# EAGLE design mosfetSwitch (EAGLE 9.2.2)
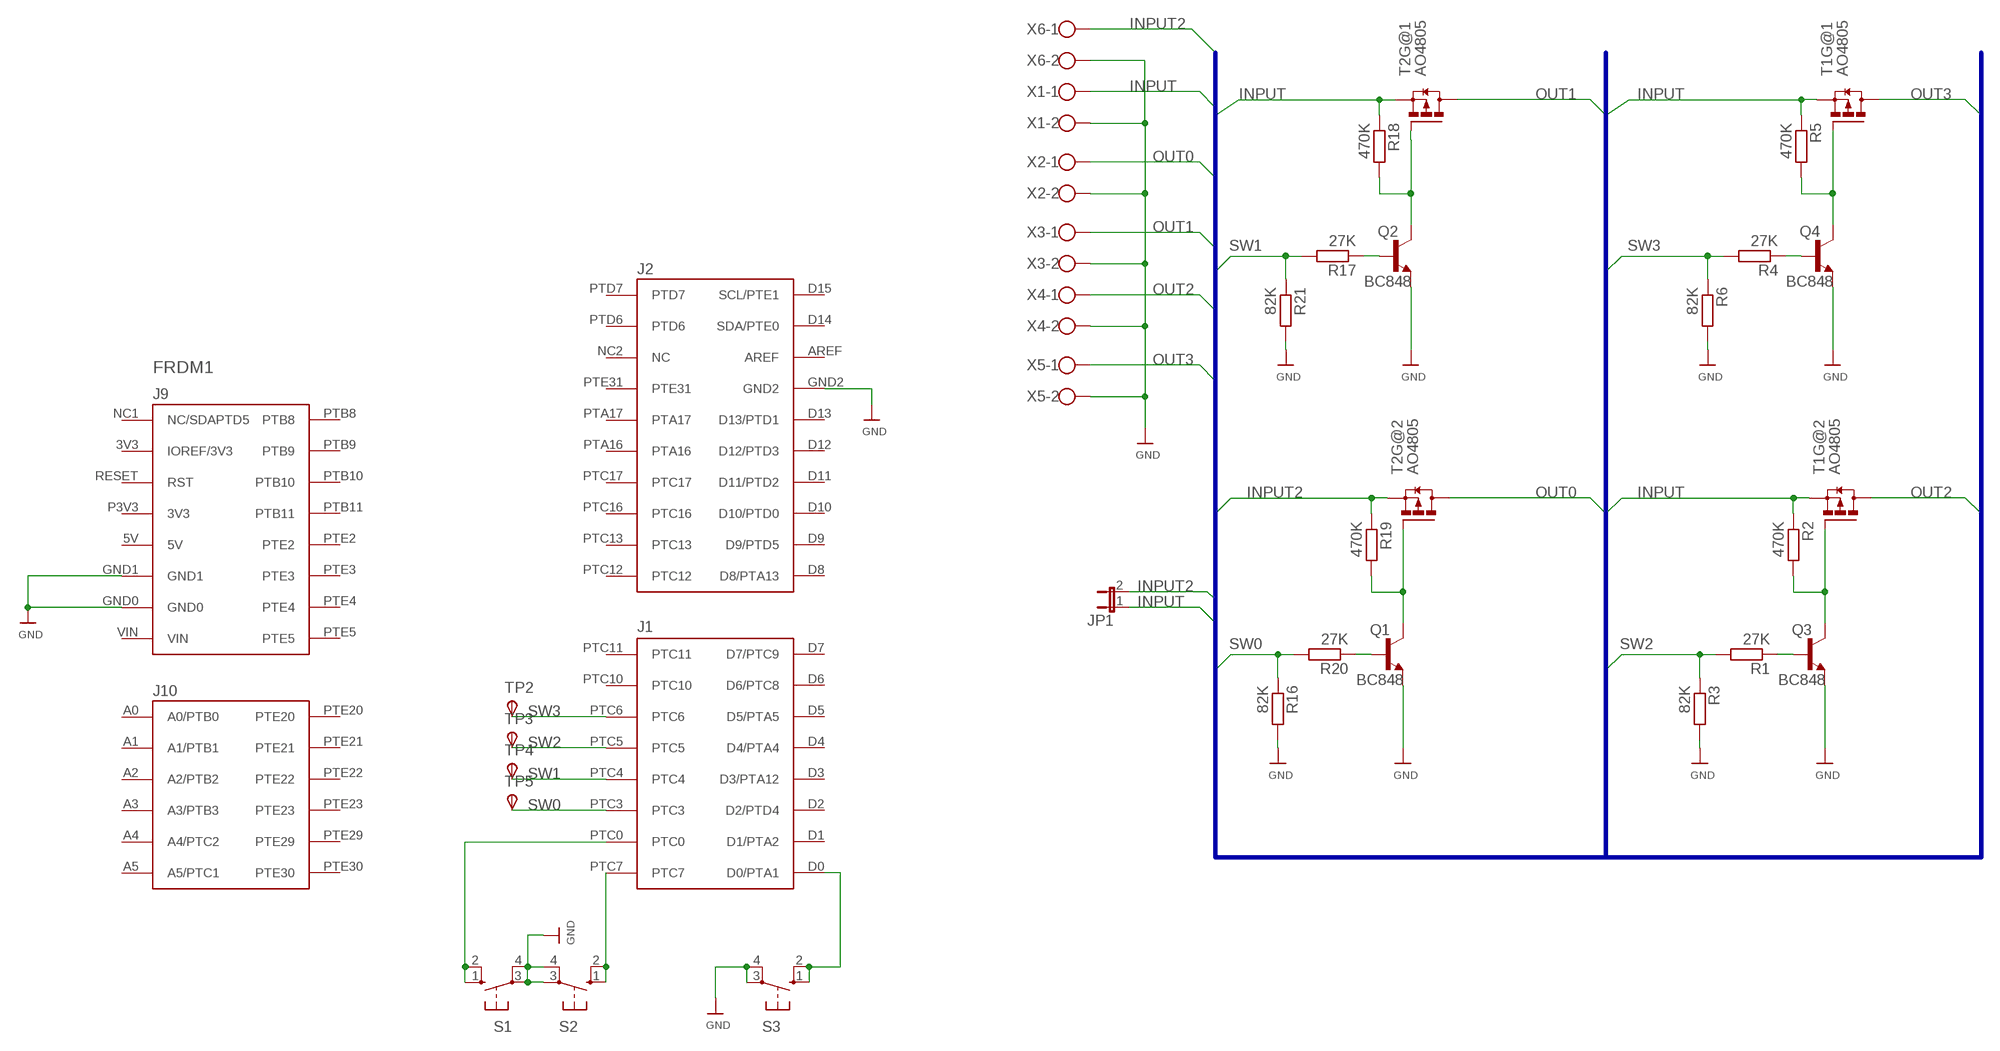
[diagram p0: schematic, sheet 1]

## Parts
FRDM1  FRDM-KL25ZNORMAL  [FRDM_KL25Z_NORMAL]
JP1  JP1E  [JP1]
Q1  BC848  [SOT23]
Q2  BC848  [SOT23]
Q3  BC848  [SOT23]
Q4  BC848  [SOT23]
R1  27K  R-EU_R0805  [R0805]
R2  470K  R-EU_R0805  [R0805]
R3  82K  R-EU_R0805  [R0805]
R4  27K  R-EU_R0805  [R0805]
R5  470K  R-EU_R0805  [R0805]
R6  82K  R-EU_R0805  [R0805]
R16  82K  R-EU_R0805  [R0805]
R17  27K  R-EU_R0805  [R0805]
R18  470K  R-EU_R0805  [R0805]
R19  470K  R-EU_R0805  [R0805]
R20  27K  R-EU_R0805  [R0805]
R21  82K  R-EU_R0805  [R0805]
S1  10-XX3D  [B3F-10XX_2]
S2  10-XX3D  [B3F-10XX_2]
S3  10-XX3D  [B3F-10XX_2]
T1  AO4805  [SOIC127P600X175-8]
T2  AO4805  [SOIC127P600X175-8]
TP2  TPSB2,54  [B2,54]
TP3  TPSB2,54  [B2,54]
TP4  TPSB2,54  [B2,54]
TP5  TPSB2,54  [B2,54]
X1  W237-102  [W237-102]
X2  W237-102  [W237-102]
X3  W237-102  [W237-102]
X4  W237-102  [W237-102]
X5  W237-102  [W237-102]
X6  W237-102  [W237-102]

## Nets
GND [power]: FRDM1.GND0 FRDM1.GND1 FRDM1.GND2 Q1.2(E) Q2.2(E) Q3.2(E) Q4.2(E) R3.2 R6.2 R16.2 R21.2 S1.3(P) S1.4(P1) S2.3(P) S2.4(P1) S3.3(P) S3.4(P1) X1.2 X2.2 X3.2 X4.2 X5.2 X6.2
INPUT [power]: JP1.1 R2.1 R5.1 R18.1 T1.1(G@2:S) T1.3(G@1:S) T2.3(G@1:S) X1.1
INPUT2 [power]: JP1.2 R19.1 T2.1(G@2:S) X6.1
N$1: Q3.1(B) R1.1
N$2: Q3.3(C) R2.2 T1.2(G@2:G)
N$3: Q2.1(B) R17.1
N$4: Q2.3(C) R18.2 T2.4(G@1:G)
N$5: Q4.1(B) R4.1
N$6: Q4.3(C) R5.2 T1.4(G@1:G)
N$7: FRDM1.PTC0 S1.1(S) S1.2(S1)
N$8: FRDM1.D0(D0/PTA1) S3.1(S) S3.2(S1)
N$9: Q1.1(B) R20.1
N$11: FRDM1.PTC7 S2.1(S) S2.2(S1)
N$21: Q1.3(C) R19.2 T2.2(G@2:G)
OUT0 [power]: T2.7(G@2:D) T2.8(G@2:D) X2.1
OUT1 [power]: T2.5(G@1:D) T2.6(G@1:D) X3.1
OUT2 [power]: T1.7(G@2:D) T1.8(G@2:D) X4.1
OUT3 [power]: T1.5(G@1:D) T1.6(G@1:D) X5.1
SW0: FRDM1.PTC3 R16.1 R20.2 TP5.TP(PP)
SW1: FRDM1.PTC4 R17.2 R21.1 TP4.TP(PP)
SW2: FRDM1.PTC5 R1.2 R3.1 TP3.TP(PP)
SW3: FRDM1.PTC6 R4.2 R6.1 TP2.TP(PP)
Unconnected: FRDM1.3V3(IOREF/3V3) FRDM1.5V FRDM1.A0(A0/PTB0) FRDM1.A1(A1/PTB1) FRDM1.A2(A2/PTB2) FRDM1.A3(A3/PTB3) FRDM1.A4(A4/PTC2) FRDM1.A5(A5/PTC1) FRDM1.AREF FRDM1.D1(D1/PTA2) FRDM1.D2(D2/PTD4) FRDM1.D3(D3/PTA12) FRDM1.D4(D4/PTA4) FRDM1.D5(D5/PTA5) FRDM1.D6(D6/PTC8) FRDM1.D7(D7/PTC9) FRDM1.D8(D8/PTA13) FRDM1.D9(D9/PTD5) FRDM1.D10(D10/PTD0) FRDM1.D11(D11/PTD2) FRDM1.D12(D12/PTD3) FRDM1.D13(D13/PTD1) FRDM1.D14(SDA/PTE0) FRDM1.D15(SCL/PTE1) FRDM1.NC1(NC/SDAPTD5) FRDM1.NC2(NC) FRDM1.P3V3(3V3) FRDM1.PTA16 FRDM1.PTA17 FRDM1.PTB8 FRDM1.PTB9 FRDM1.PTB10 FRDM1.PTB11 FRDM1.PTC10 FRDM1.PTC11 FRDM1.PTC12 FRDM1.PTC13 FRDM1.PTC16 FRDM1.PTC17 FRDM1.PTD6 FRDM1.PTD7 FRDM1.PTE2 FRDM1.PTE3 FRDM1.PTE4 FRDM1.PTE5 FRDM1.PTE20 FRDM1.PTE21 FRDM1.PTE22 FRDM1.PTE23 FRDM1.PTE29 FRDM1.PTE30 FRDM1.PTE31 FRDM1.RESET(RST) FRDM1.VIN

## Buses
INPUT,INPUT2,OUT[0..5],SW[0..5]

## Library data of the parts
FRDM1 = Freedom:FRDM-KL25Z: For creating FRDM-KL25Z shields
JP1 = jumper:JP1E: JUMPER
Q1-Q4 = transistor:BC848: NPN TRANSISTOR
R1-R6 R16-R21 = rcl:R-EU_: RESISTOR, European symbol; SPICEPREFIX: R
S1-S3 = misc:10-XX: OMRON SWITCH
T1 T2 = tranzistor:AO4805: Tranzistor: P-MOSFET x2; unipolárny; -30V; -7A; 1,3W; https://www.tme.eu/sk/details/ao4805/tranzistory-viackanalove/alpha-omega-semiconductor/; TME_SYMBOL: AO4805
TP2-TP5 = testpad:TPS: TEST PIN
X1-X6 = con-wago-500:W237-102: WAGO SCREW CLAMP; MPN: 237-102; OC_FARNELL: unknown; OC_NEWARK: 70K9898

## Net classes
0 default: width 0.406 mm, drill 1.016 mm, clearance 0.305 mm
1 power: width 1.067 mm, drill 0.508 mm, clearance 0.305 mm
2 lowPower: width 0.406 mm, drill 0.305 mm, clearance 0.254 mm

## Board
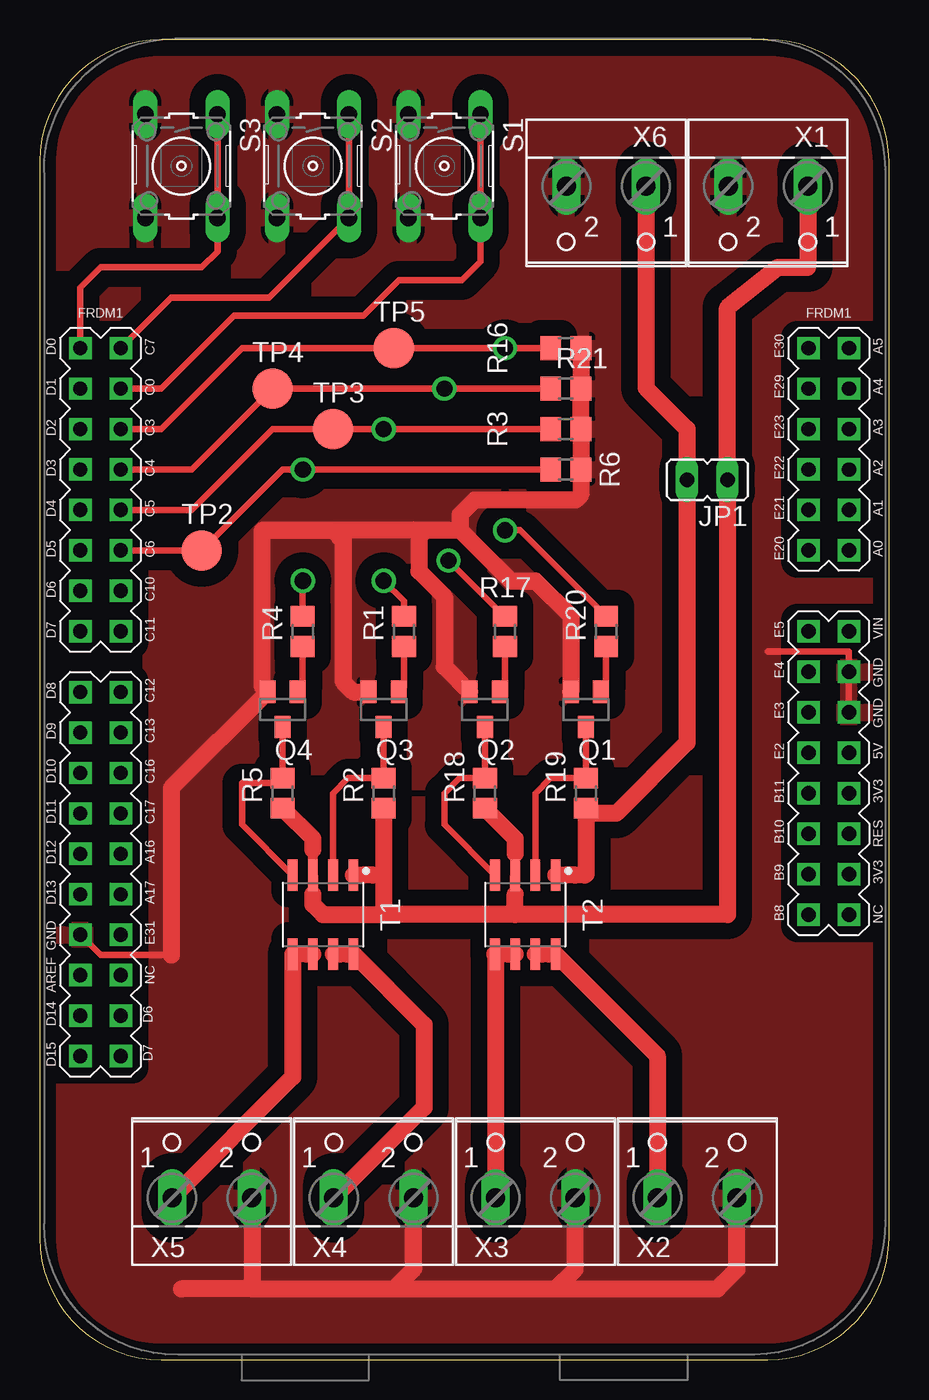
[diagram p1: board, top side]
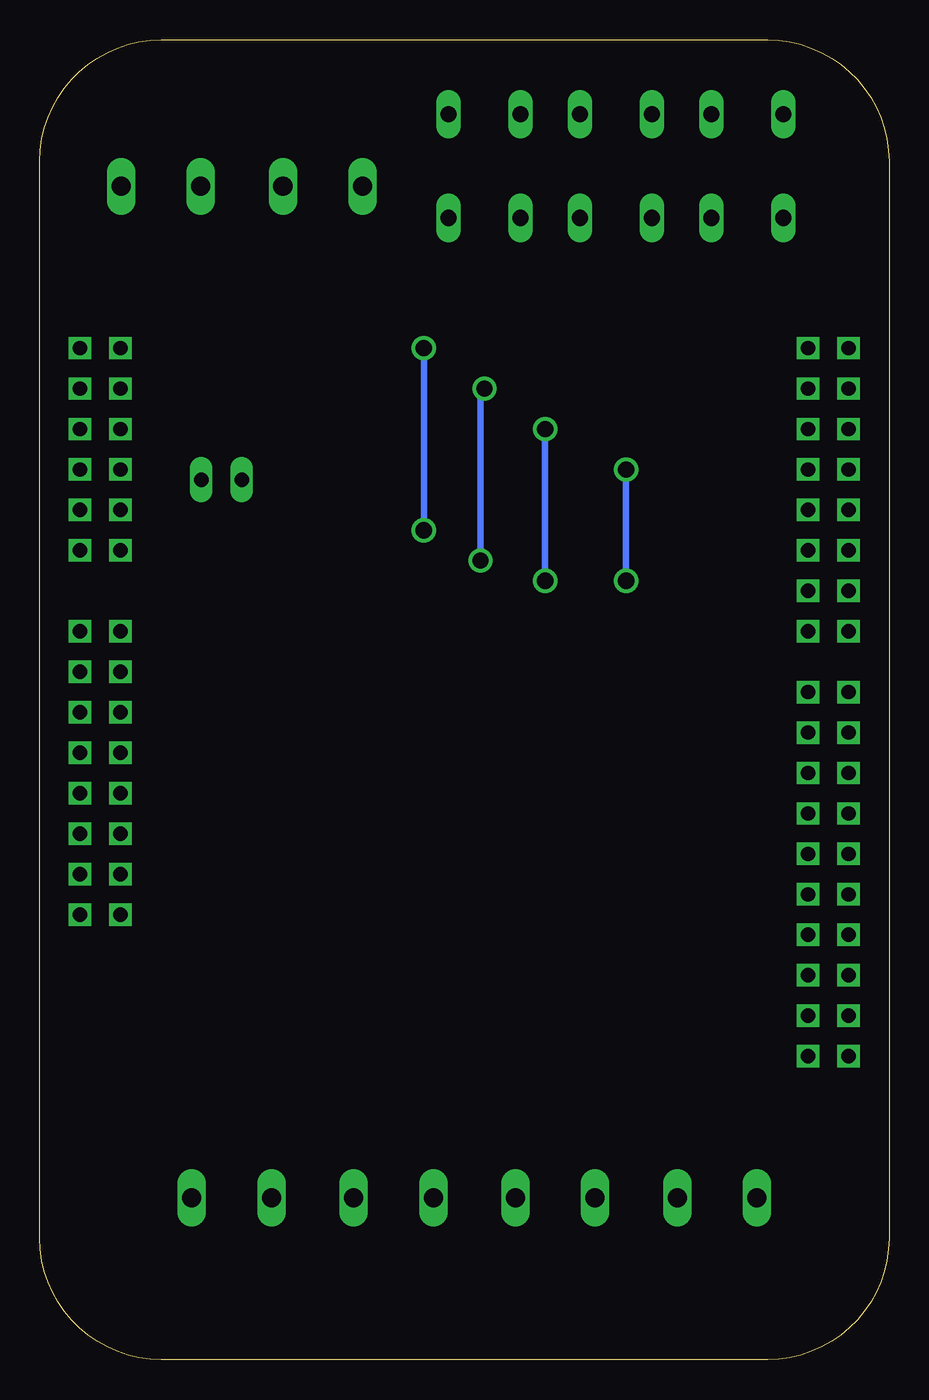
[diagram p2: board, bottom side, seen from below]

Size 53.32 x 82.86 mm. Coordinates in mm from the lower left corner, seen from the top.
Outline: 0,75.23 0,7.62 arc90 7.62,0 45.7,0 arc90 53.32,7.62 53.32,75.23 arc90 45.7,82.86 7.62,82.86 arc90 0,75.23
Copper layers (1*16): Top 0.035mm / dielectric 1.5mm / Bottom 0.035mm
Design rules "default": minimum track width 6mil, minimum drill 0.35mm, track to track 6mil, track to pad 6mil, pad to pad 6mil, via to via 6mil, smd to smd 6mil, copper to edge 40mil, drill to drill 6mil, minimum pad ring 10mil, minimum via ring 8mil, stop-mask expansion 4mil, vias tented up to drill 0mil, thermal gap 10mil

### Footprints (pad centres in the part's own frame; a part is rotated, then mirrored left to right if it is on the bottom)
FRDM_KL25Z_NORMAL = drill 0.9 square: 3V3 24.13,-15.24; 5V 24.13,-7.62; A0 24.13,5.08; A1 24.13,7.62; A2 24.13,10.16; A3 24.13,12.7; A4 24.13,15.24; A5 24.13,17.78; AREF -24.13,-21.59; D0 -24.13,17.78; D1 -24.13,15.24; D2 -24.13,12.7; D3 -24.13,10.16; D4 -24.13,7.62; D5 -24.13,5.08; D6 -24.13,2.54; D7 -24.13,0; D8 -24.13,-3.81; D9 -24.13,-6.35; D10 -24.13,-8.89; D11 -24.13,-11.43; D12 -24.13,-13.97; D13 -24.13,-16.51; D14 -24.13,-24.13; D15 -24.13,-26.67; GND0 24.13,-2.54; GND1 24.13,-5.08; GND2 -24.13,-19.05; NC1 24.13,-17.78; NC2 -21.59,-21.59; P3V3 24.13,-10.16; PTA16 -21.59,-13.97; PTA17 -21.59,-16.51; PTB8 21.59,-17.78; PTB9 21.59,-15.24; PTB10 21.59,-12.7; PTB11 21.59,-10.16; PTC0 -21.59,15.24; PTC3 -21.59,12.7; PTC4 -21.59,10.16; PTC5 -21.59,7.62; PTC6 -21.59,5.08; PTC7 -21.59,17.78; PTC10 -21.59,2.54; PTC11 -21.59,0; PTC12 -21.59,-3.81; PTC13 -21.59,-6.35; PTC16 -21.59,-8.89; PTC17 -21.59,-11.43; PTD6 -21.59,-24.13; PTD7 -21.59,-26.67; PTE2 21.59,-7.62; PTE3 21.59,-5.08; PTE4 21.59,-2.54; PTE5 21.59,0; PTE20 21.59,5.08; PTE21 21.59,7.62; PTE22 21.59,10.16; PTE23 21.59,12.7; PTE29 21.59,15.24; PTE30 21.59,17.78; PTE31 -21.59,-19.05; RESET 24.13,-12.7; VIN 24.13,0
JP1 = drill 0.914 long: 1 0,-1.27; 2 0,1.27
SOT23 = smd 1 x 1.4: 1 -0.95,-1.1; 2 0.95,-1.1; 3 0,1.1
R0805 = smd 1.3 x 1.5: 1 -0.95,0; 2 0.95,0
B3F-10XX_2 = drill 1.016 long: 1 -3.251,2.261; 2 3.251,2.261; 3 -3.251,-2.261; 4 3.251,-2.261
SOIC127P600X175-8 = smd 1.97 x 0.605: 1 -2.473,1.905; 2 -2.473,0.635; 3 -2.473,-0.635; 4 -2.473,-1.905; 5 2.473,-1.905; 6 2.473,-0.635; 7 2.473,0.635; 8 2.473,1.905
B2,54 = smd 2.54 x 2.54: TP 0,0
W237-102 = drill 1.194 long: 1 -2.5,-1.27; 2 2.5,-1.27

### Placement (x,y rotation side)
FRDM1  26.67,45.72 0 top
JP1  41.91,55.24 90 top
Q1  34.29,40.82 180 top
Q2  27.94,40.82 180 top
Q3  21.59,40.82 180 top
Q4  15.24,40.82 180 top
R1  22.86,45.72 90 top
R2  21.59,35.56 90 top
R3  33.02,58.42 0 top
R4  16.51,45.72 90 top
R5  15.24,35.56 90 top
R6  33.02,55.88 0 top
R16  33.02,63.5 0 top
R17  29.21,45.72 90 top
R18  27.94,35.56 90 top
R19  34.29,35.56 90 top
R20  35.56,45.72 90 top
R21  33.02,60.96 0 top
S1  25.4,74.93 270 top
S2  17.14,74.93 270 top
S3  8.89,74.93 270 top
T1  17.78,27.94 270 top
T2  30.48,27.94 270 top
TP2  10.16,50.8 0 top
TP3  18.41,58.42 0 top
TP4  14.61,60.96 0 top
TP5  22.23,63.5 0 top
X1  45.72,72.39 180 top
X2  41.27,11.43 0 top
X3  31.11,11.43 0 top
X4  20.95,11.43 0 top
X5  10.79,11.43 0 top
X6  35.56,72.39 180 top

### Tracks (layer width: path | path; a pad name or v marks a point on that pad's centre or on a via)
GND
  Top 0.406: FRDM1.GND2 3.81,25.4 8.26,25.4 | 45.72,44.45 50.8,44.45 FRDM1.GND1
  Top 1.067: R16.2 R21.2 R3.2 R6.2 33.97,54.29 33.66,53.98 27.3,53.98 26.39,53.06 26.39,52.07 | 18.41,52.07 13.97,52.07 13.97,42.24 Q4.2 8.26,35.89 8.26,25.4 | 18.41,52.07 19.05,51.44 19.05,42.55 19.67,41.92 Q3.2 | 23.5,52.07 18.41,52.07 | 23.5,52.07 26.39,52.07 | 23.5,52.07 23.8,51.77 23.8,49.5 25.4,47.9 25.4,43.51 Q2.2 | 26.39,52.07 29.57,48.9 31.11,48.9 33.34,46.67 Q1.2 | X5.2 13.34,10.12 13.34,4.45 | 13.34,4.45 22.23,4.45 | 22.23,4.45 23.5,5.71 23.45,5.75 X4.2 | 32.38,4.45 33.62,5.67 X3.2 | 22.23,4.45 32.38,4.45 | 32.38,4.45 42.55,4.45 43.77,5.67 X2.2 | 13.34,4.45 8.89,4.45
  pour Top (isolate 1.016): 0,74.93 0,7.62 arc90 7.62,0 45.72,0 arc90 53.34,7.62 53.34,74.93 arc90 45.72,82.55 7.62,82.55 arc90
INPUT
  Top 0.635: 29.84,29.21 T2.3 29.84,31.75 | 17.14,29.21 17.14,32 | T1.3 17.14,28.57
  Top 1.067: R18.1 29.84,32.7 29.84,31.75 | R5.1 17.14,32.7 17.14,32 | 21.59,27.94 17.78,27.94 17.14,28.57 17.14,29.21 | X1.1 48.22,68.58 46.35,68.58 43.18,66.04 JP1.1 43.18,27.94 29.84,27.94 | 29.84,27.94 21.59,27.94 | 21.52,30.41 21.59,30.48 R2.1 | 21.52,30.41 arc1 T1.1 | 21.52,30.41 21.59,30.34 21.59,27.94 | 29.84,27.94 29.84,29.21
INPUT2
  Top 1.067: X6.1 38.06,61 40.64,58.42 JP1.2 40.64,38.73 36.2,34.29 34.61,34.29 R19.1 34.29,30.48 34.22,30.41 arc1 T2.1
N$1
  Top 0.406: Q3.1 22.86,42.24 R1.1
N$2
  Top 0.406: Q3.3 R2.2 19.36,36.51 18.41,35.56 T1.2
N$3
  Top 0.406: Q2.1 29.21,42.24 R17.1
N$4
  Top 0.406: Q2.3 R18.2 26.35,36.51 25.4,35.56 25.4,33.59 T2.4
N$5
  Top 0.406: R4.1 16.51,42.24 Q4.1
N$6
  Top 0.406: Q4.3 R5.2 15.02,36.51 14.66,36.14 14.61,36.2 12.7,36.2 12.7,33.59 T1.4
N$7
  Top 0.406: FRDM1.PTC0 7.62,60.96 12.21,65.55 20.32,65.55 22.54,67.77 26.49,67.77 27.66,68.94 S1.2 27.66,71.75 S1.1
N$8
  Top 0.406: FRDM1.D0 2.54,67.31 3.81,68.58 10.16,68.58 11.15,69.57 S3.2 S3.1
N$9
  Top 0.406: Q1.1 35.56,42.24 R20.1
N$11
  Top 0.406: 5.64,64.06 FRDM1.PTC7 8.26,66.67 14.4,66.67 S2.2 S2.1
N$21
  Top 0.406: Q1.3 R19.2 32.06,36.51 31.11,35.56 T2.2
OUT0
  Top 1.067: X2.1 38.77,19.08 T2.8 arc1 T2.7
OUT1
  Top 1.067: X3.1 28.61,25.43 T2.5 arc-1 T2.6
OUT2
  Top 1.067: X4.1 24.13,15.84 24.13,21.02 T1.8 arc1 T1.7
OUT3
  Top 1.067: X5.1 15.88,17.74 T1.5 arc-1 T1.6
SW0  (via drill 1.02)
  Top 0.406: R16.1 v29.21,63.5 22.86,63.5 TP5.TP 12.7,63.5 7.62,58.42 FRDM1.PTC3 | v29.21,52.07 30.16,52.07 R20.2
  Bottom 0.406: v29.21,52.07 v29.21,63.5
SW1  (via drill 1.02)
  Top 0.406: R21.1 v25.4,60.96 TP4.TP 9.53,55.88 FRDM1.PTC4 | R17.2 29.15,46.67 v25.65,50.16
  Bottom 0.406: v25.4,60.96 25.65,60.71 v25.65,50.16
SW2  (via drill 1.02)
  Top 0.406: R3.1 v21.59,58.42 19.05,58.42 TP3.TP 14.61,58.42 9.53,53.34 FRDM1.PTC5 | v21.59,48.9 22.86,47.62 R1.2
  Bottom 0.406: v21.59,48.9 v21.59,58.42
SW3  (via drill 1.02)
  Top 0.406: R6.1 v16.51,55.88 15.24,55.88 TP2.TP FRDM1.PTC6 | R4.2 v16.51,48.9
  Bottom 0.406: v16.51,48.9 v16.51,55.88